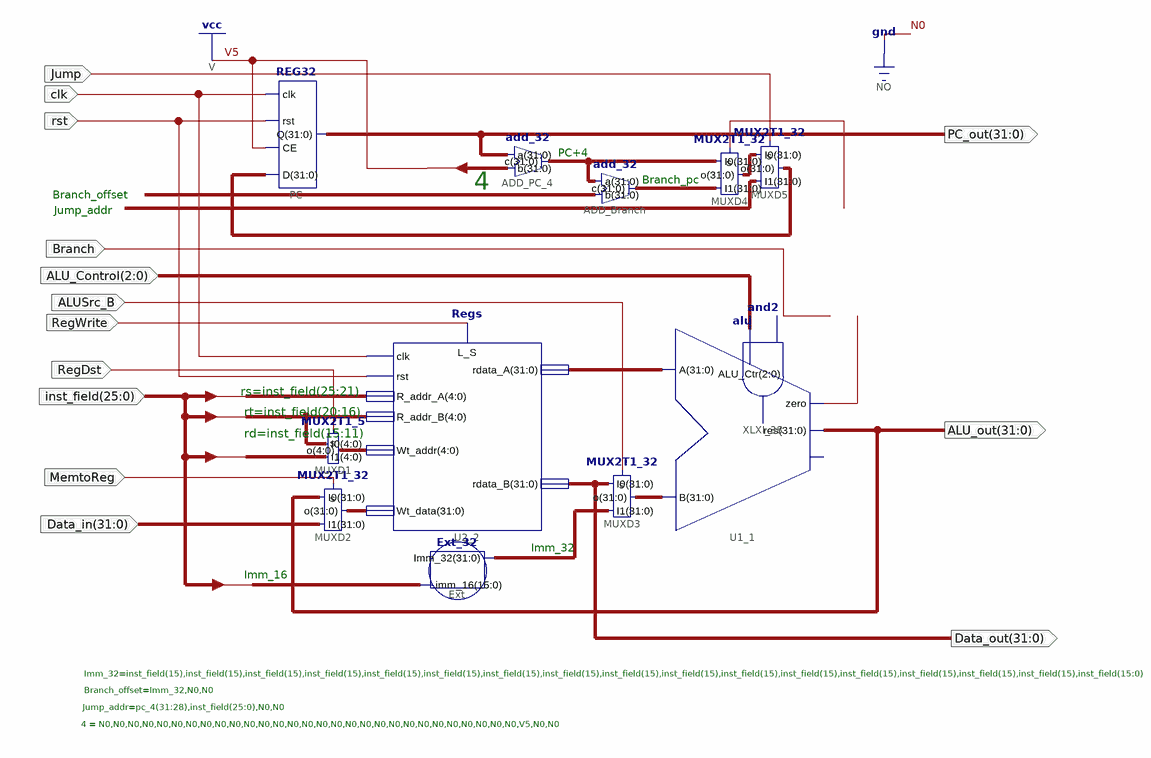
[diagram p0: schematic sheet 1]
// Xilinx ISE schematic SDPath.sch (kintex7) as structural Verilog: 12 symbols, 14 ports
module SDPath (
  input  RegDst,
  input  [31:0] Data_in,
  input  ALUSrc_B,
  input  Branch,
  input  RegWrite,
  input  MemtoReg,
  input  clk,
  input  rst,
  input  [2:0] ALU_Control,
  input  [25:0] inst_field,
  input  Jump,
  output [31:0] Data_out,
  output [31:0] PC_out,
  output [31:0] ALU_out
);

  wire XLXN_468, XLXN_540;
  wire [4:0] XLXN_59;
  wire [31:0] branch_addr, Imm_32, pc_4, XLXN_414, XLXN_519, XLXN_530, XLXN_531, XLXN_580;

  alu U1_1 (.ALU_Ctr(ALU_Control), .res(ALU_out), .zero(XLXN_468), .A(XLXN_530), .B(XLXN_531));  // open: overflow
  Regs U2_2 (
    .clk(clk), .L_S(RegWrite), .rdata_A(XLXN_530), .rst(rst), .Wt_data(XLXN_414), .rdata_B(Data_out),
    .R_addr_A(inst_field[25:21]), .R_addr_B(inst_field[20:16]), .Wt_addr(XLXN_59));
  and XLXI_38 (XLXN_540, Branch, XLXN_468);
  add_32 ADD_Branch (.b({Imm_32[29:0], 2'b00}), .a(pc_4), .c(branch_addr));
  add_32 ADD_PC_4 (.b(32'b00000000000000000000000000000100), .a(PC_out), .c(pc_4));
  Ext_32 Ext (.imm_16(inst_field[15:0]), .Imm_32(Imm_32));
  REG32 PC (.D(XLXN_519), .CE(1'b1), .rst(rst), .clk(clk), .Q(PC_out));
  MUX2T1_32 MUXD2 (.s(MemtoReg), .I0(ALU_out), .I1(Data_in), .o(XLXN_414));
  MUX2T1_32 MUXD3 (.s(ALUSrc_B), .I0(Data_out), .I1(Imm_32), .o(XLXN_531));
  MUX2T1_32 MUXD5 (.s(Jump), .I0(XLXN_580), .I1({pc_4[31:28], inst_field, 2'b00}), .o(XLXN_519));
  MUX2T1_5 MUXD1 (.I1(inst_field[15:11]), .I0(inst_field[20:16]), .o(XLXN_59), .s(RegDst));
  MUX2T1_32 MUXD4 (.s(XLXN_540), .I0(pc_4), .I1(branch_addr), .o(XLXN_580));

  // Notes on the sheet:
  //   PC+4
  //   Branch_pc
  //   4
  //   Branch_offset
  //   Jump_addr
  //   rs=inst_field(25:21)
  //   rt=inst_field(20:16)
  //   rd=inst_field(15:11)
  //   Imm_32
  //   Imm_16
  //   Imm_32=inst_field(15),inst_field(15),inst_field(15),inst_field(15),inst_field(15),inst_field(15),inst_field(15),inst_field(15),inst_field(15),inst_field(15),inst_field(15),inst_field(15),inst_field(15),inst_field(15),inst_field(15),inst_field(15),inst_field(15:0)
  //   Branch_offset=Imm_32,N0,N0
  //   Jump_addr=pc_4(31:28),inst_field(25:0),N0,N0
  //   4 = N0,N0,N0,N0,N0,N0,N0,N0,N0,N0,N0,N0,N0,N0,N0,N0,N0,N0,N0,N0,N0,N0,N0,N0,N0,N0,N0,N0,N0,V5,N0,N0
endmodule
